# Altium schematic sheet top1.SchDoc
size A4
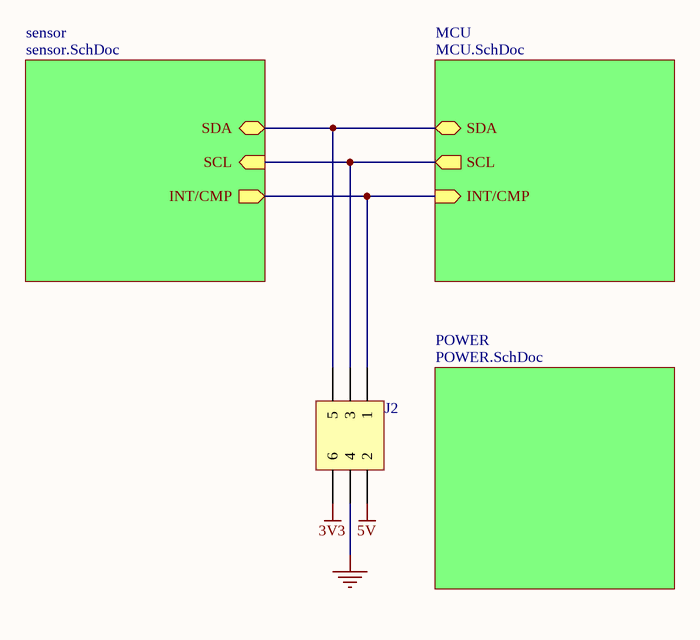
[diagram p0: top1.SchDoc]

## Parts
J2  Header 3X2  [HDR2X3]  (value not drawn)

## Sub-sheets
MCU = MCU.SchDoc: SDA (bidir), SCL (out), INT/CMP (in)
POWER = POWER.SchDoc: no entries
sensor = sensor.SchDoc: SDA (bidir), SCL (in), INT/CMP (out)

## Nets
3V3: J2.6
5V: J2.2
GND: J2.4
NetJ2_1: J2.1 ; sheet sensor/INT/CMP, sheet MCU/INT/CMP
NetJ2_3: J2.3 ; sheet sensor/SCL, sheet MCU/SCL
NetJ2_5: J2.5 ; sheet sensor/SDA, sheet MCU/SDA

## Library data of the parts
J2 = Header 3X2: Header, 3-Pin, Dual row; LatestRevisionDate: 17-Jul-2002; LatestRevisionNote: Re-released for DXP Platform.; Publisher: Altium Limited